# EAGLE schematic Gen6 REV0.1 (EAGLE 8.3.1)

## Sheet 1 of 4
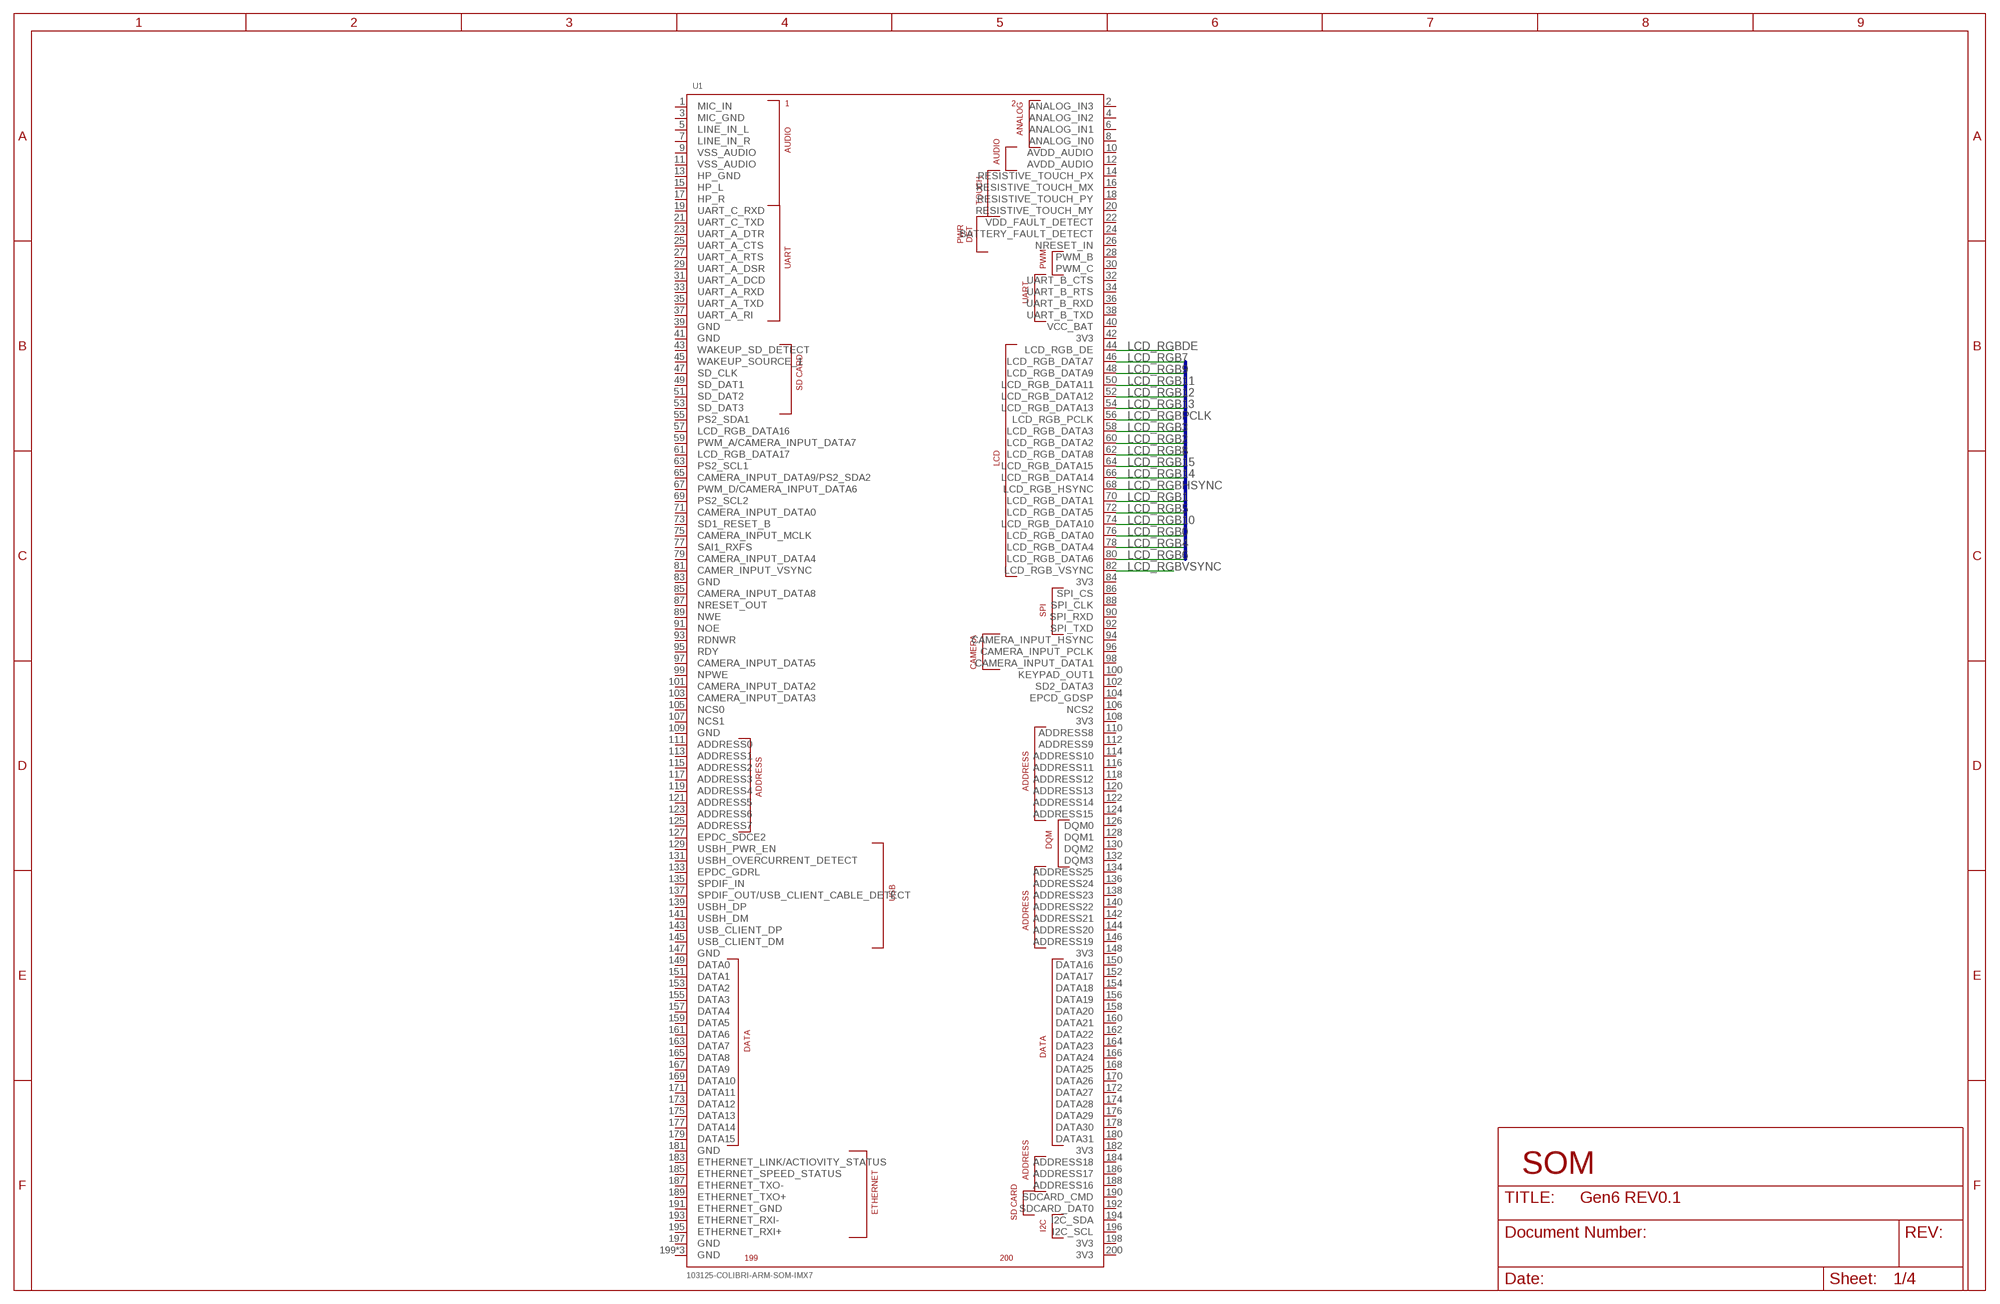
[diagram p0: schematic, sheet 1]

### Parts
U1  103125-COLIBRI-ARM-SOM-IMX7  [SO-DIMM(200)]

### Nets
LCD_RGB0: U1.76(LCD_RGB_DATA0)
LCD_RGB1: U1.70(LCD_RGB_DATA1)
LCD_RGB2: U1.60(LCD_RGB_DATA2)
LCD_RGB3: U1.58(LCD_RGB_DATA3)
LCD_RGB4: U1.78(LCD_RGB_DATA4)
LCD_RGB5: U1.72(LCD_RGB_DATA5)
LCD_RGB6: U1.80(LCD_RGB_DATA6)
LCD_RGB7: U1.46(LCD_RGB_DATA7)
LCD_RGB8: U1.62(LCD_RGB_DATA8)
LCD_RGB9: U1.48(LCD_RGB_DATA9)
LCD_RGB10: U1.74(LCD_RGB_DATA10)
LCD_RGB11: U1.50(LCD_RGB_DATA11)
LCD_RGB12: U1.52(LCD_RGB_DATA12)
LCD_RGB13: U1.54(LCD_RGB_DATA13)
LCD_RGB14: U1.66(LCD_RGB_DATA14)
LCD_RGB15: U1.64(LCD_RGB_DATA15)
LCD_RGBDE: U1.44(LCD_RGB_DE)
LCD_RGBHSYNC: U1.68(LCD_RGB_HSYNC)
LCD_RGBPCLK: U1.56(LCD_RGB_PCLK)
LCD_RGBVSYNC: U1.82(LCD_RGB_VSYNC)
Unconnected: U1.1(MIC_IN) U1.2(ANALOG_IN3) U1.3(MIC_GND) U1.4(ANALOG_IN2) U1.5(LINE_IN_L) U1.6(ANALOG_IN1) U1.7(LINE_IN_R) U1.8(ANALOG_IN0) U1.10(AVDD_AUDIO) U1.12(AVDD_AUDIO) U1.13(HP_GND) U1.14(RESISTIVE_TOUCH_PX) U1.15(HP_L) U1.16(RESISTIVE_TOUCH_MX) U1.17(HP_R) U1.18(RESISTIVE_TOUCH_PY) U1.19(UART_C_RXD) U1.20(RESISTIVE_TOUCH_MY) U1.21(UART_C_TXD) U1.22(VDD_FAULT_DETECT) U1.23(UART_A_DTR) U1.24(BATTERY_FAULT_DETECT) U1.25(UART_A_CTS) U1.26(NRESET_IN) U1.27(UART_A_RTS) U1.28(PWM_B) U1.29(UART_A_DSR) U1.30(PWM_C) U1.31(UART_A_DCD) U1.32(UART_B_CTS) U1.33(UART_A_RXD) U1.34(UART_B_RTS) U1.35(UART_A_TXD) U1.36(UART_B_RXD) U1.37(UART_A_RI) U1.38(UART_B_TXD) U1.40(VCC_BAT) U1.42(3V3) U1.43(WAKEUP_SD_DETECT) U1.45(WAKEUP_SOURCE_1) U1.47(SD_CLK) U1.49(SD_DAT1) U1.51(SD_DAT2) U1.53(SD_DAT3) U1.55(PS2_SDA1) U1.57(LCD_RGB_DATA16) U1.59(PWM_A/CAMERA_INPUT_DATA7) U1.61(LCD_RGB_DATA17) U1.63(PS2_SCL1) U1.65(CAMERA_INPUT_DATA9/PS2_SDA2) U1.67(PWM_D/CAMERA_INPUT_DATA6) U1.69(PS2_SCL2) U1.71(CAMERA_INPUT_DATA0) U1.73(SD1_RESET_B) U1.75(CAMERA_INPUT_MCLK) U1.77(SAI1_RXFS) U1.79(CAMERA_INPUT_DATA4) U1.81(CAMER_INPUT_VSYNC) U1.83(GND) U1.84(3V3) U1.85(CAMERA_INPUT_DATA8) U1.86(SPI_CS) U1.87(NRESET_OUT) U1.88(SPI_CLK) U1.89(NWE) U1.90(SPI_RXD) U1.91(NOE) U1.92(SPI_TXD) U1.93(RDNWR) U1.94(CAMERA_INPUT_HSYNC) U1.95(RDY) U1.96(CAMERA_INPUT_PCLK) U1.97(CAMERA_INPUT_DATA5) U1.98(CAMERA_INPUT_DATA1) U1.99(NPWE) U1.100(KEYPAD_OUT1) U1.101(CAMERA_INPUT_DATA2) U1.102(SD2_DATA3) U1.103(CAMERA_INPUT_DATA3) U1.104(EPCD_GDSP) U1.105(NCS0) U1.106(NCS2) U1.107(NCS1) U1.108(3V3) U1.109(GND) U1.110(ADDRESS8) U1.111(ADDRESS0) U1.112(ADDRESS9) U1.113(ADDRESS1) U1.114(ADDRESS10) U1.115(ADDRESS2) U1.116(ADDRESS11) U1.117(ADDRESS3) U1.118(ADDRESS12) U1.119(ADDRESS4) U1.120(ADDRESS13) U1.121(ADDRESS5) U1.122(ADDRESS14) U1.123(ADDRESS6) U1.124(ADDRESS15) U1.125(ADDRESS7) U1.126(DQM0) U1.127(EPDC_SDCE2) U1.128(DQM1) U1.129(USBH_PWR_EN) U1.130(DQM2) U1.131(USBH_OVERCURRENT_DETECT) U1.132(DQM3) U1.133(EPDC_GDRL) U1.134(ADDRESS25) U1.135(SPDIF_IN) U1.136(ADDRESS24) U1.137(SPDIF_OUT/USB_CLIENT_CABLE_DETECT) U1.138(ADDRESS23) U1.139(USBH_DP) U1.140(ADDRESS22) U1.141(USBH_DM) U1.142(ADDRESS21) U1.143(USB_CLIENT_DP) U1.144(ADDRESS20) U1.145(USB_CLIENT_DM) U1.146(ADDRESS19) U1.147(GND) U1.148(3V3) U1.149(DATA0) U1.150(DATA16) U1.151(DATA1) U1.152(DATA17) U1.153(DATA2) U1.154(DATA18) U1.155(DATA3) U1.156(DATA19) U1.157(DATA4) U1.158(DATA20) U1.159(DATA5) U1.160(DATA21) U1.161(DATA6) U1.162(DATA22) U1.163(DATA7) U1.164(DATA23) U1.165(DATA8) U1.166(DATA24) U1.167(DATA9) U1.168(DATA25) U1.169(DATA10) U1.170(DATA26) U1.171(DATA11) U1.172(DATA27) U1.173(DATA12) U1.174(DATA28) U1.175(DATA13) U1.176(DATA29) U1.177(DATA14) U1.178(DATA30) U1.179(DATA15) U1.180(DATA31) U1.181(GND) U1.182(3V3) U1.183(ETHERNET_LINK/ACTIOVITY_STATUS) U1.184(ADDRESS18) U1.185(ETHERNET_SPEED_STATUS) U1.186(ADDRESS17) U1.187(ETHERNET_TXO-) U1.188(ADDRESS16) U1.189(ETHERNET_TXO+) U1.190(SDCARD_CMD) U1.191(ETHERNET_GND) U1.192(SDCARD_DAT0) U1.193(ETHERNET_RXI-) U1.194(I2C_SDA) U1.195(ETHERNET_RXI+) U1.196(I2C_SCL) U1.197(GND) U1.198(3V3) U1.199(GND) U1.200(3V3) U1.M1(GND) U1.M2(GND)

### Buses
LCD_RGB[0..16]

### Notes on the sheet
- SOM

## Sheet 2 of 4
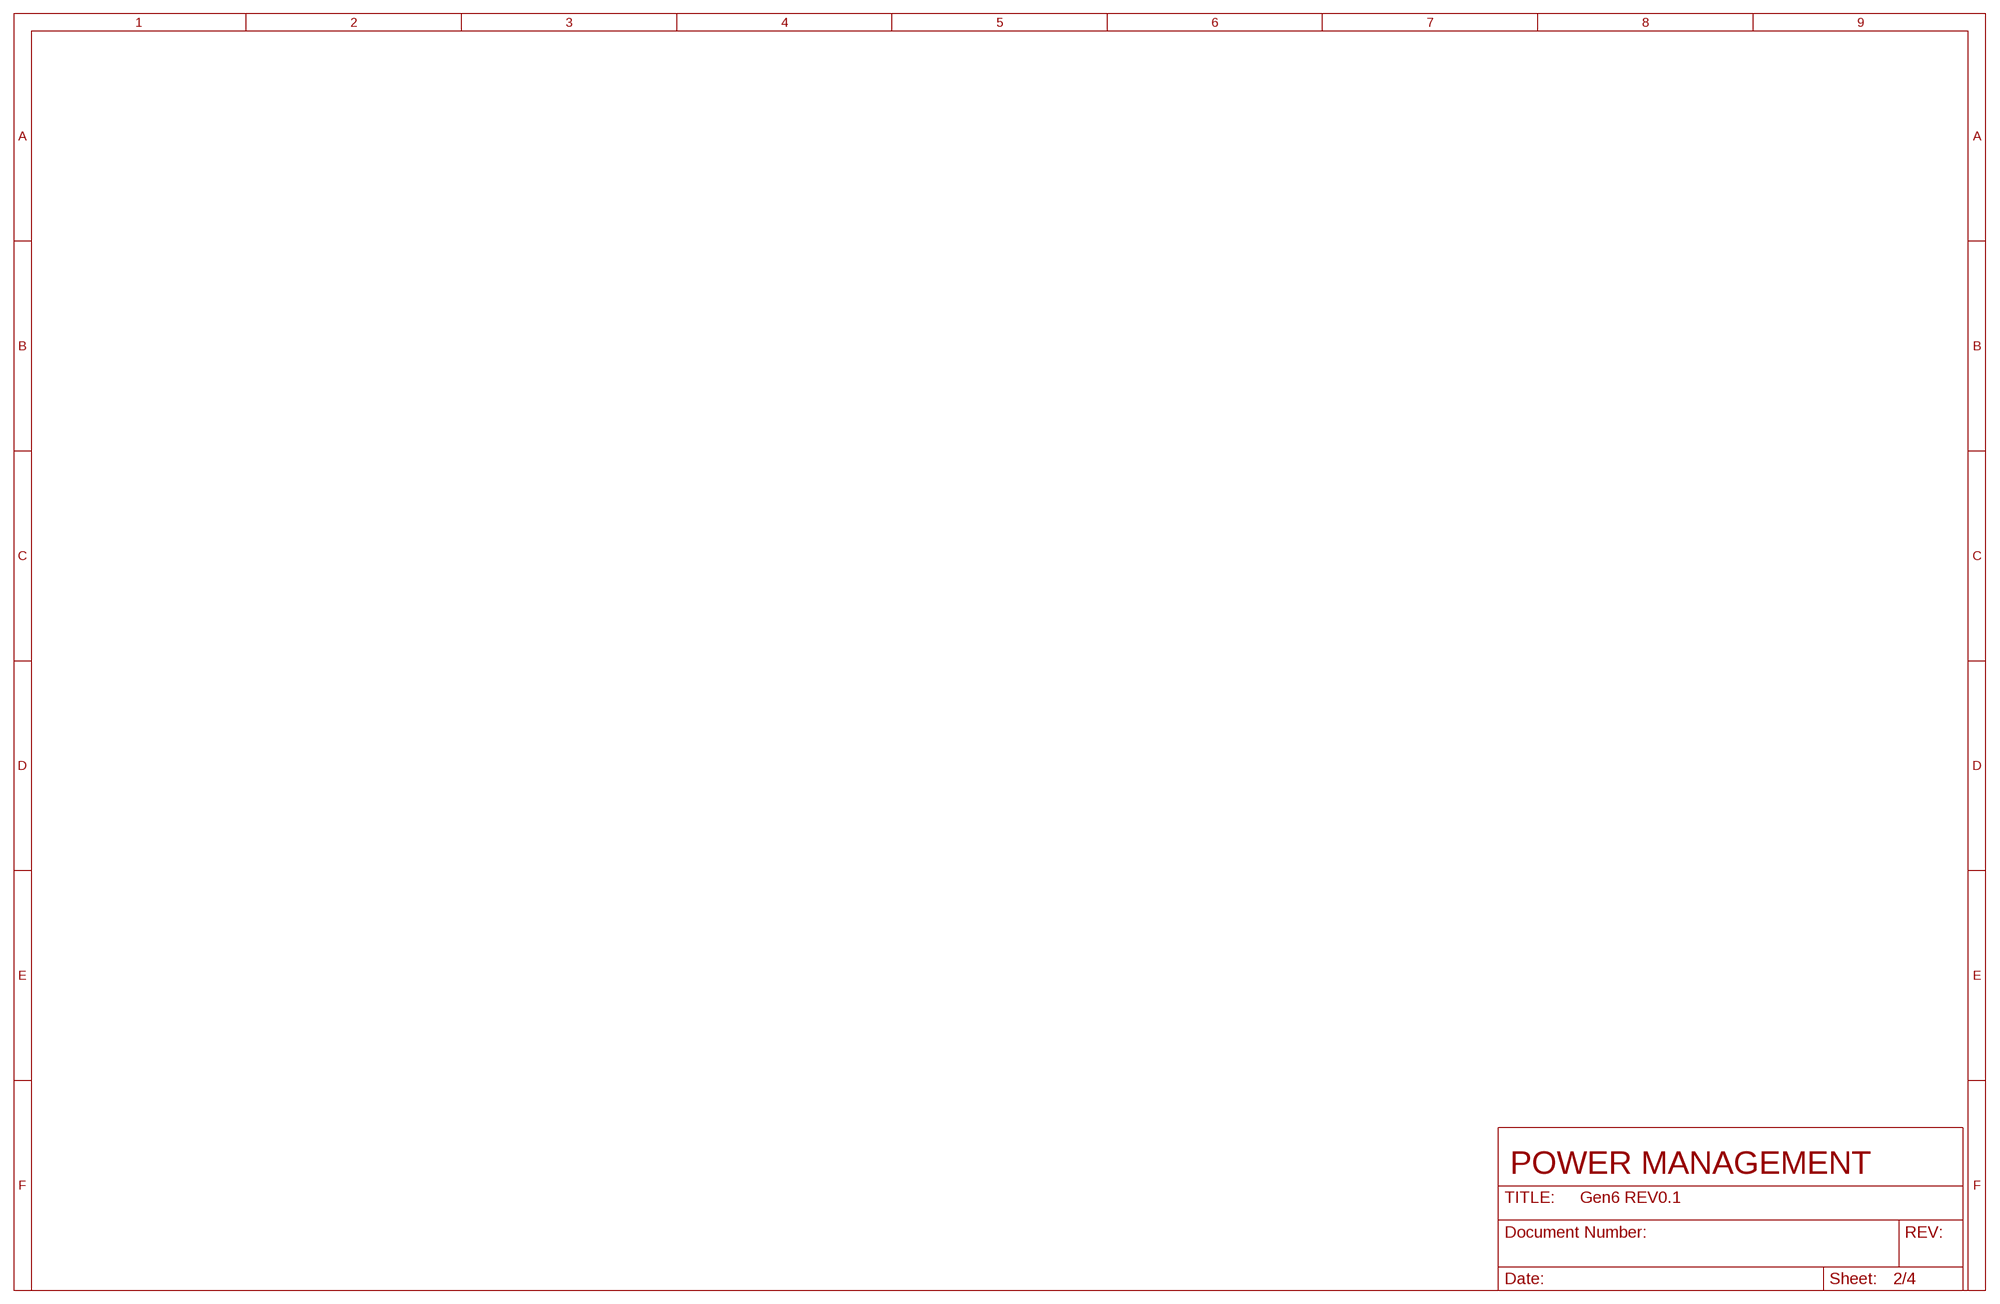
[diagram p1: schematic, sheet 2]

### Notes on the sheet
- POWER MANAGEMENT

## Sheet 3 of 4
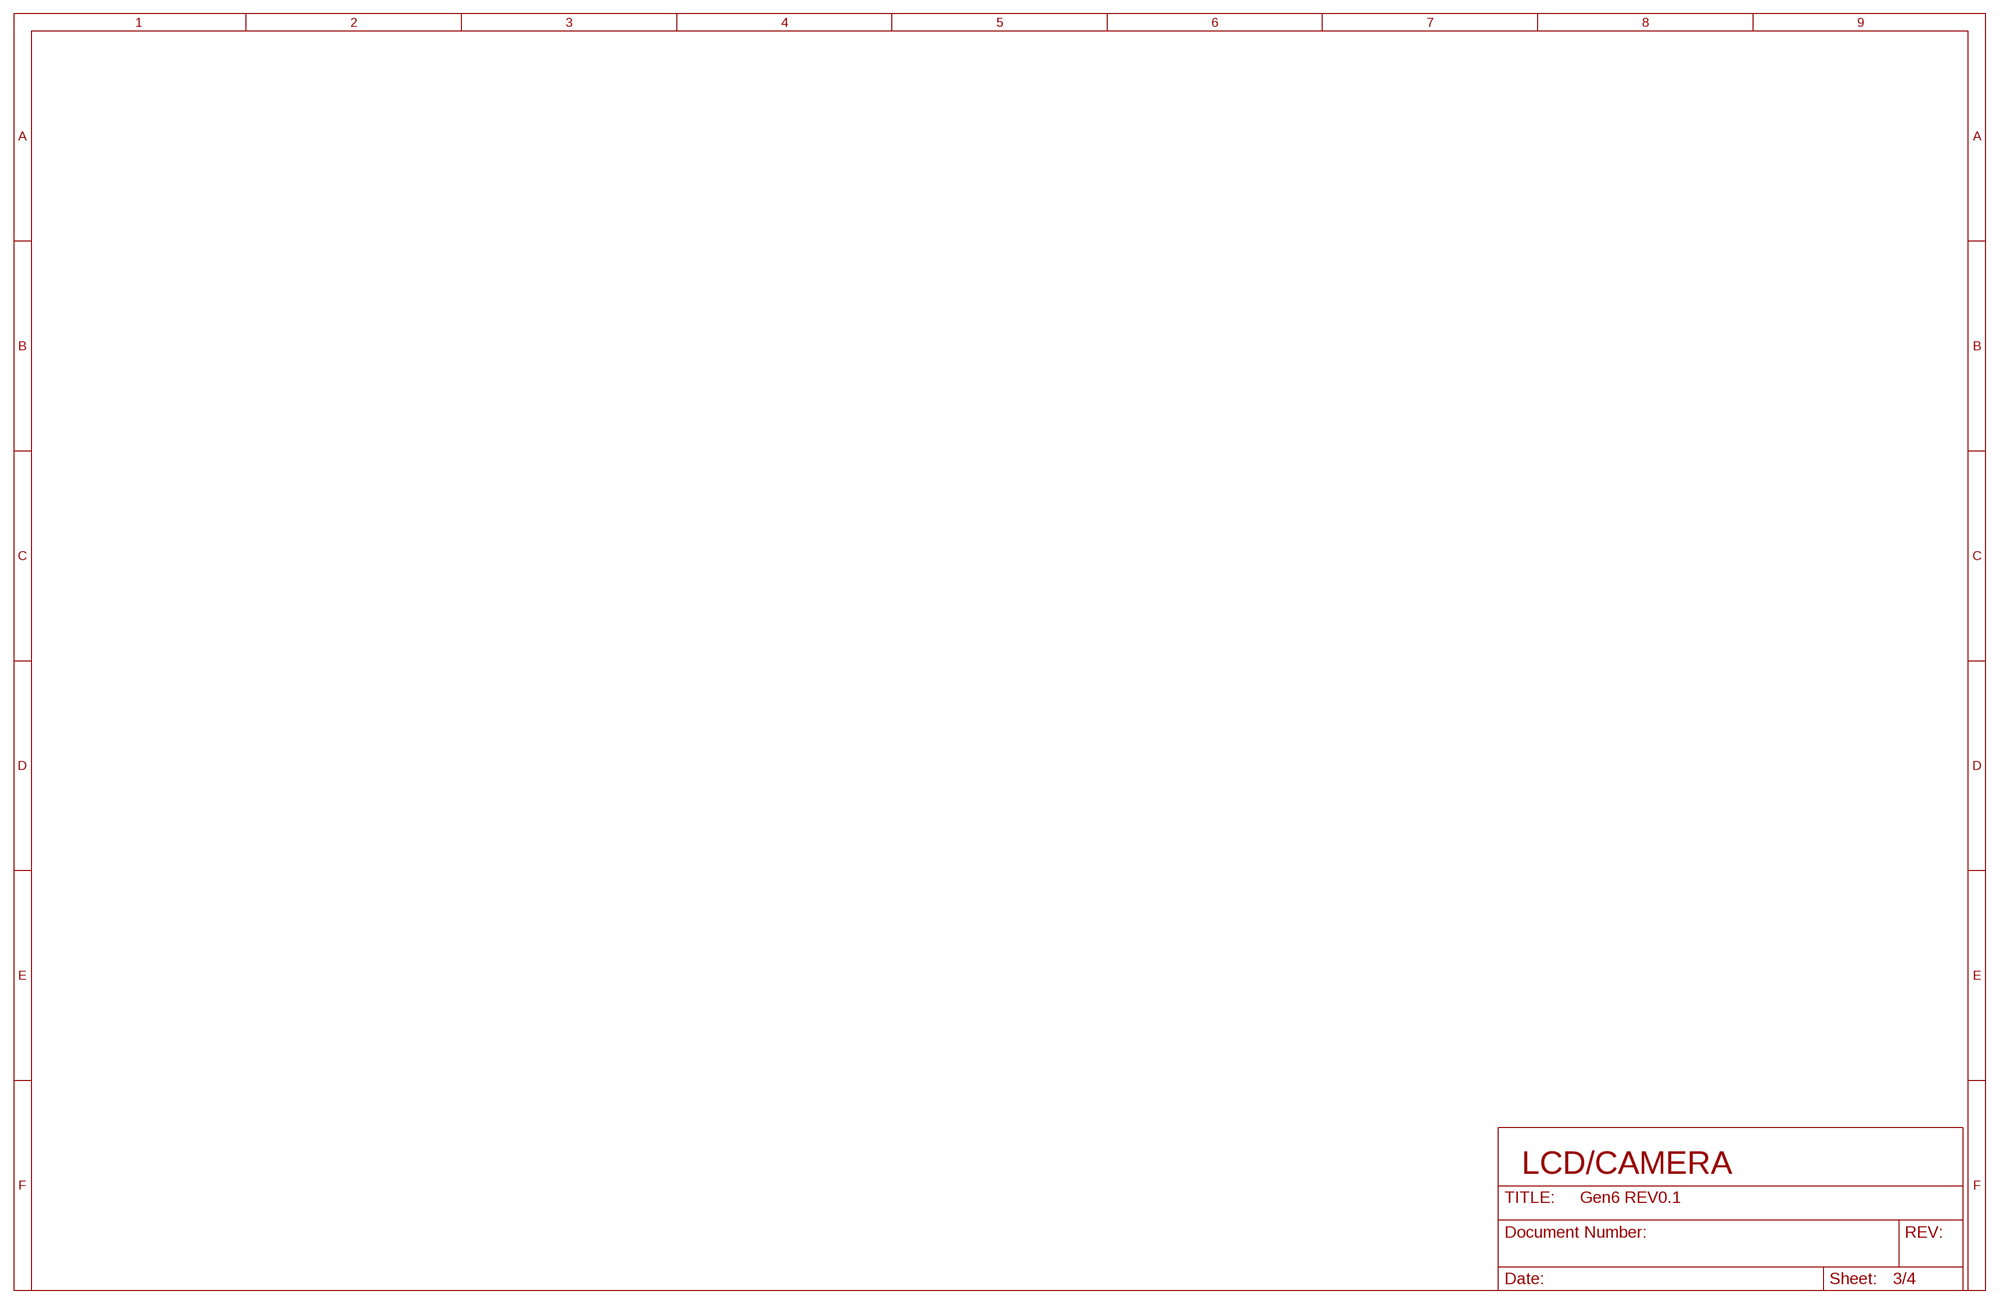
[diagram p2: schematic, sheet 3]

### Notes on the sheet
- LCD/CAMERA

## Sheet 4 of 4
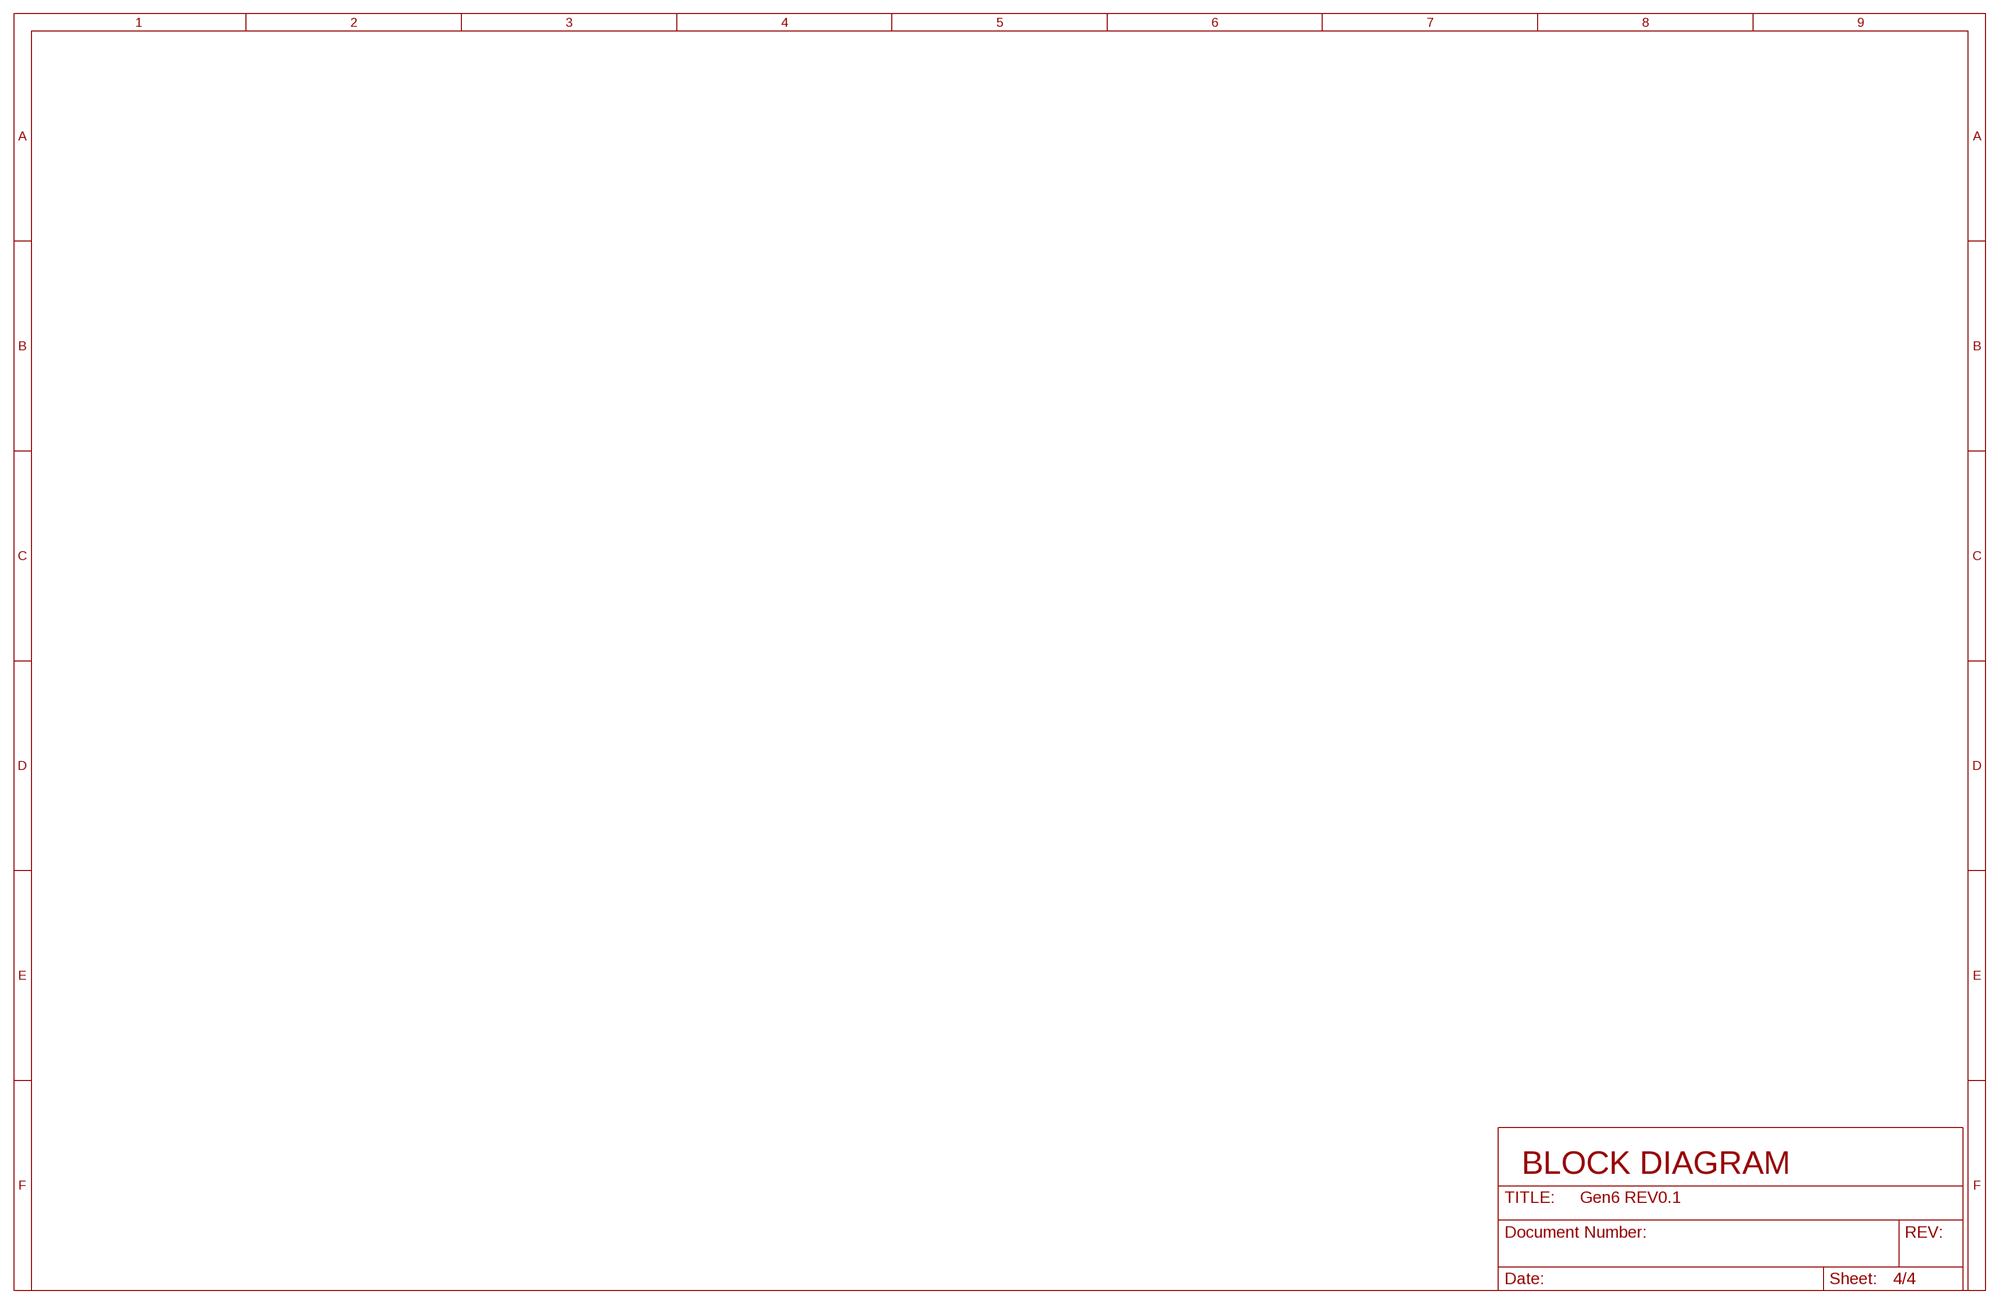
[diagram p3: schematic, sheet 4]

### Notes on the sheet
- BLOCK DIAGRAM

## Power pins joined to a net without a drawn wire
GND: U1.39(GND) U1.41(GND)
VSS_AUDIO: U1.9(VSS_AUDIO) U1.11(VSS_AUDIO)

## Library data of the parts
U1 = clackboard_lib:103125-COLIBRI-ARM-SOM-IMX7